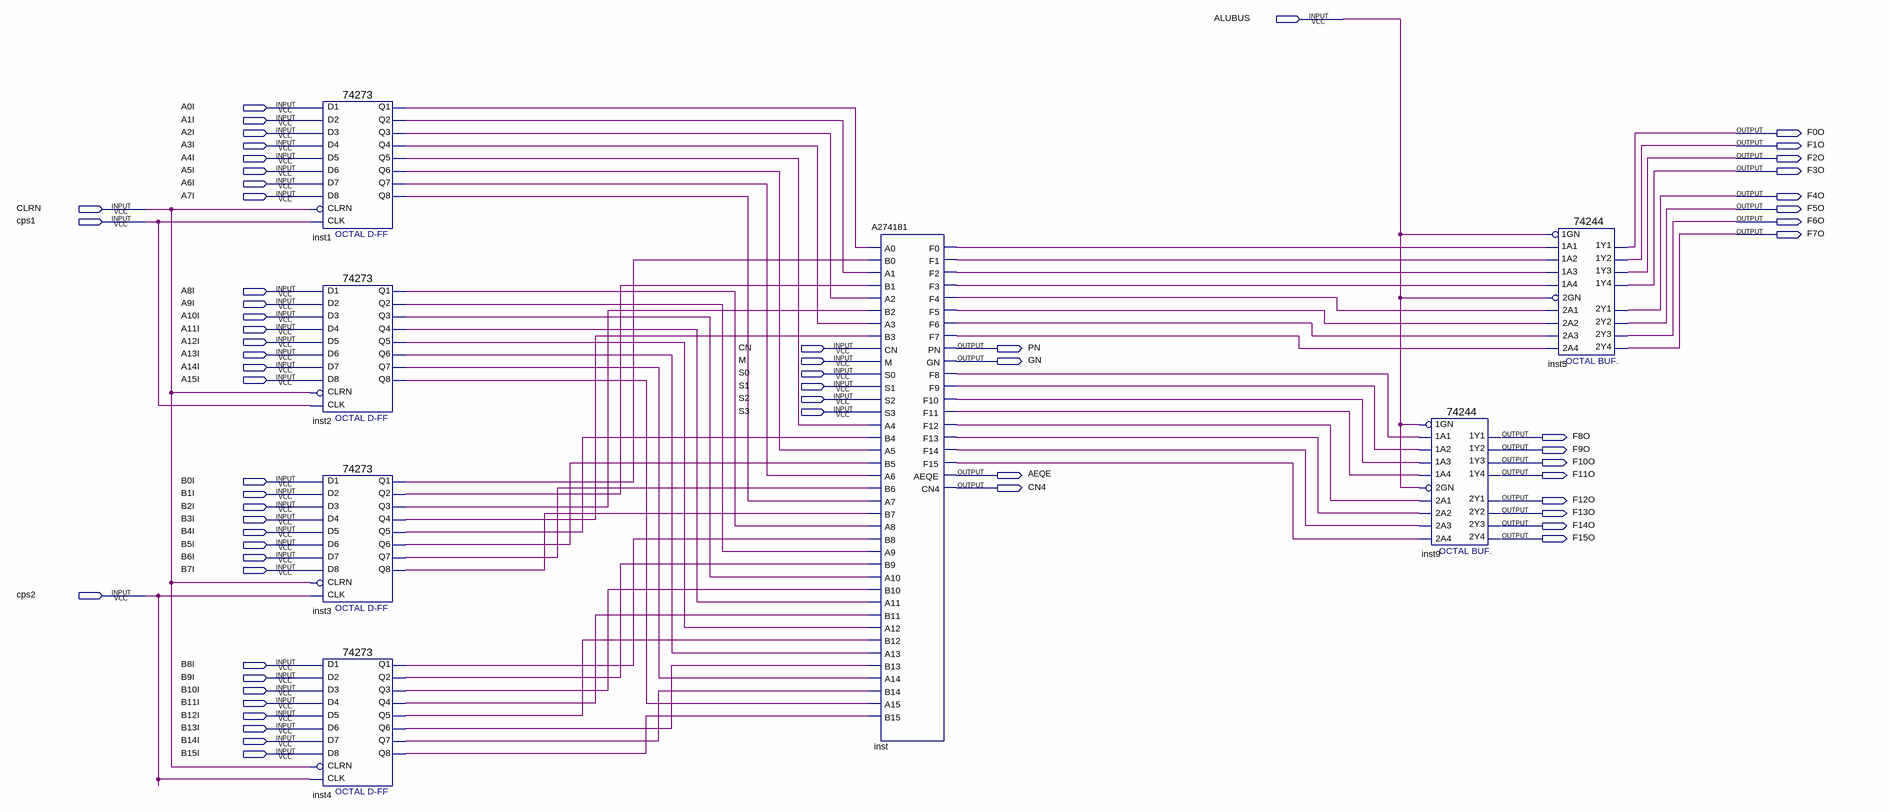
[diagram p0: schematic sheet]
// Quartus schematic A274273.bdf as structural Verilog: 7 symbols, 62 pins
module A274273 (
  input  ALUBUS,
  input  A0I,
  input  A1I,
  input  A2I,
  input  A3I,
  input  A4I,
  input  A5I,
  input  A6I,
  input  A7I,
  input  CLRN,
  input  cps1,
  input  A8I,
  input  A9I,
  input  A10I,
  input  A11I,
  input  A12I,
  input  CN,
  input  A13I,
  input  M,
  input  A14I,
  input  S0,
  input  A15I,
  input  S1,
  input  S2,
  input  S3,
  input  B0I,
  input  B1I,
  input  B2I,
  input  B3I,
  input  B4I,
  input  B5I,
  input  B6I,
  input  B7I,
  input  cps2,
  input  B8I,
  input  B9I,
  input  B10I,
  input  B11I,
  input  B12I,
  input  B13I,
  input  B14I,
  input  B15I,
  output F0O,
  output F1O,
  output F2O,
  output F3O,
  output F4O,
  output F5O,
  output F6O,
  output F7O,
  output PN,
  output GN,
  output F8O,
  output F9O,
  output F10O,
  output AEQE,
  output F11O,
  output CN4,
  output F12O,
  output F13O,
  output F14O,
  output F15O
);

  wire inst1_q1, inst1_q2, inst1_q3, inst1_q4, inst1_q5, inst1_q6, inst1_q7, inst1_q8, inst2_q1, inst2_q2,
       inst2_q3, inst2_q4, inst2_q5, inst2_q6, inst2_q7, inst2_q8, inst3_q1, inst3_q2, inst3_q3, inst3_q4,
       inst3_q5, inst3_q6, inst3_q7, inst3_q8, inst4_q1, inst4_q2, inst4_q3, inst4_q4, inst4_q5, inst4_q6,
       inst4_q7, inst4_q8, inst_f0, inst_f1, inst_f2, inst_f3, inst_f4, inst_f5, inst_f6, inst_f7, inst_f8,
       inst_f9, inst_f10, inst_f11, inst_f12, inst_f13, inst_f14, inst_f15;

  \74273  inst1 (
    .D2(A1I), .D3(A2I), .D1(A0I), .D4(A3I), .D7(A6I), .D6(A5I), .D5(A4I), .D8(A7I), .CLK(cps1), .CLRN(CLRN),
    .Q4(inst1_q4), .Q1(inst1_q1), .Q2(inst1_q2), .Q3(inst1_q3), .Q6(inst1_q6), .Q5(inst1_q5), .Q7(inst1_q7),
    .Q8(inst1_q8));
  \74273  inst2 (
    .D2(A9I), .D3(A10I), .D1(A8I), .D4(A11I), .D7(A14I), .D6(A13I), .D5(A12I), .D8(A15I), .CLK(cps1),
    .CLRN(CLRN), .Q4(inst2_q4), .Q1(inst2_q1), .Q2(inst2_q2), .Q3(inst2_q3), .Q6(inst2_q6), .Q5(inst2_q5),
    .Q7(inst2_q7), .Q8(inst2_q8));
  \74273  inst3 (
    .D2(B1I), .D3(B2I), .D1(B0I), .D4(B3I), .D7(B6I), .D6(B5I), .D5(B4I), .D8(B7I), .CLK(cps2), .CLRN(CLRN),
    .Q4(inst3_q4), .Q1(inst3_q1), .Q2(inst3_q2), .Q3(inst3_q3), .Q6(inst3_q6), .Q5(inst3_q5), .Q7(inst3_q7),
    .Q8(inst3_q8));
  \74273  inst4 (
    .D2(B9I), .D3(B10I), .D1(B8I), .D4(B11I), .D7(B14I), .D6(B13I), .D5(B12I), .D8(B15I), .CLK(cps2),
    .CLRN(CLRN), .Q4(inst4_q4), .Q1(inst4_q1), .Q2(inst4_q2), .Q3(inst4_q3), .Q6(inst4_q6), .Q5(inst4_q5),
    .Q7(inst4_q7), .Q8(inst4_q8));
  A274181 inst (
    .A0(inst1_q1), .B0(inst3_q1), .A1(inst1_q2), .B1(inst3_q2), .A2(inst1_q3), .B2(inst3_q3), .A3(inst1_q4),
    .B3(inst3_q4), .CN(CN), .M(M), .S0(S0), .S1(S1), .S2(S2), .S3(S3), .A4(inst1_q5), .B4(inst3_q5),
    .A5(inst1_q6), .B5(inst3_q6), .A6(inst1_q7), .B6(inst3_q7), .A7(inst1_q8), .B7(inst3_q8), .A8(inst2_q1),
    .B8(inst4_q1), .A9(inst2_q2), .B9(inst4_q2), .A10(inst2_q3), .B10(inst4_q3), .A11(inst2_q4),
    .B11(inst4_q4), .A12(inst2_q5), .B12(inst4_q5), .A13(inst2_q6), .B13(inst4_q6), .A14(inst2_q7),
    .B14(inst4_q7), .A15(inst2_q8), .B15(inst4_q8), .F0(inst_f0), .F1(inst_f1), .F2(inst_f2), .F3(inst_f3),
    .F4(inst_f4), .F5(inst_f5), .F6(inst_f6), .F7(inst_f7), .PN(PN), .GN(GN), .F8(inst_f8), .F9(inst_f9),
    .F10(inst_f10), .F11(inst_f11), .F12(inst_f12), .F13(inst_f13), .F14(inst_f14), .F15(inst_f15),
    .AEQE(AEQE), .CN4(CN4));
  \74244  inst9 (
    .\1A2 (inst_f9), .\1A4 (inst_f11), .\1A1 (inst_f8), .\1A3 (inst_f10), .\1GN (ALUBUS), .\2A3 (inst_f14),
    .\2GN (ALUBUS), .\2A1 (inst_f12), .\2A4 (inst_f15), .\2A2 (inst_f13), .\1Y2 (F9O), .\1Y4 (F11O),
    .\2Y1 (F12O), .\1Y1 (F8O), .\2Y3 (F14O), .\2Y4 (F15O), .\1Y3 (F10O), .\2Y2 (F13O));
  \74244  inst5 (
    .\1A2 (inst_f1), .\1A4 (inst_f3), .\1A1 (inst_f0), .\1A3 (inst_f2), .\1GN (ALUBUS), .\2A3 (inst_f6),
    .\2GN (ALUBUS), .\2A1 (inst_f4), .\2A4 (inst_f7), .\2A2 (inst_f5), .\1Y2 (F1O), .\1Y4 (F3O), .\2Y1 (F4O),
    .\1Y1 (F0O), .\2Y3 (F6O), .\2Y4 (F7O), .\1Y3 (F2O), .\2Y2 (F5O));
endmodule
